# Altium schematic sheet EEM_Connectors.SchDoc: Grabber_DIOT
size 420 x 297 mm; DrawnBy: MMroz; Address1: Warsaw Univeristy of Technology; Address2: Nowowiejska 15/19; SheetNumber: 4; SheetTotal: 5; SPICEModelCacheUDDSOIAX: <root> / <DocumentId>UDDSOIAX</DocumentId> / </root>; Title2: EEM_Connectors
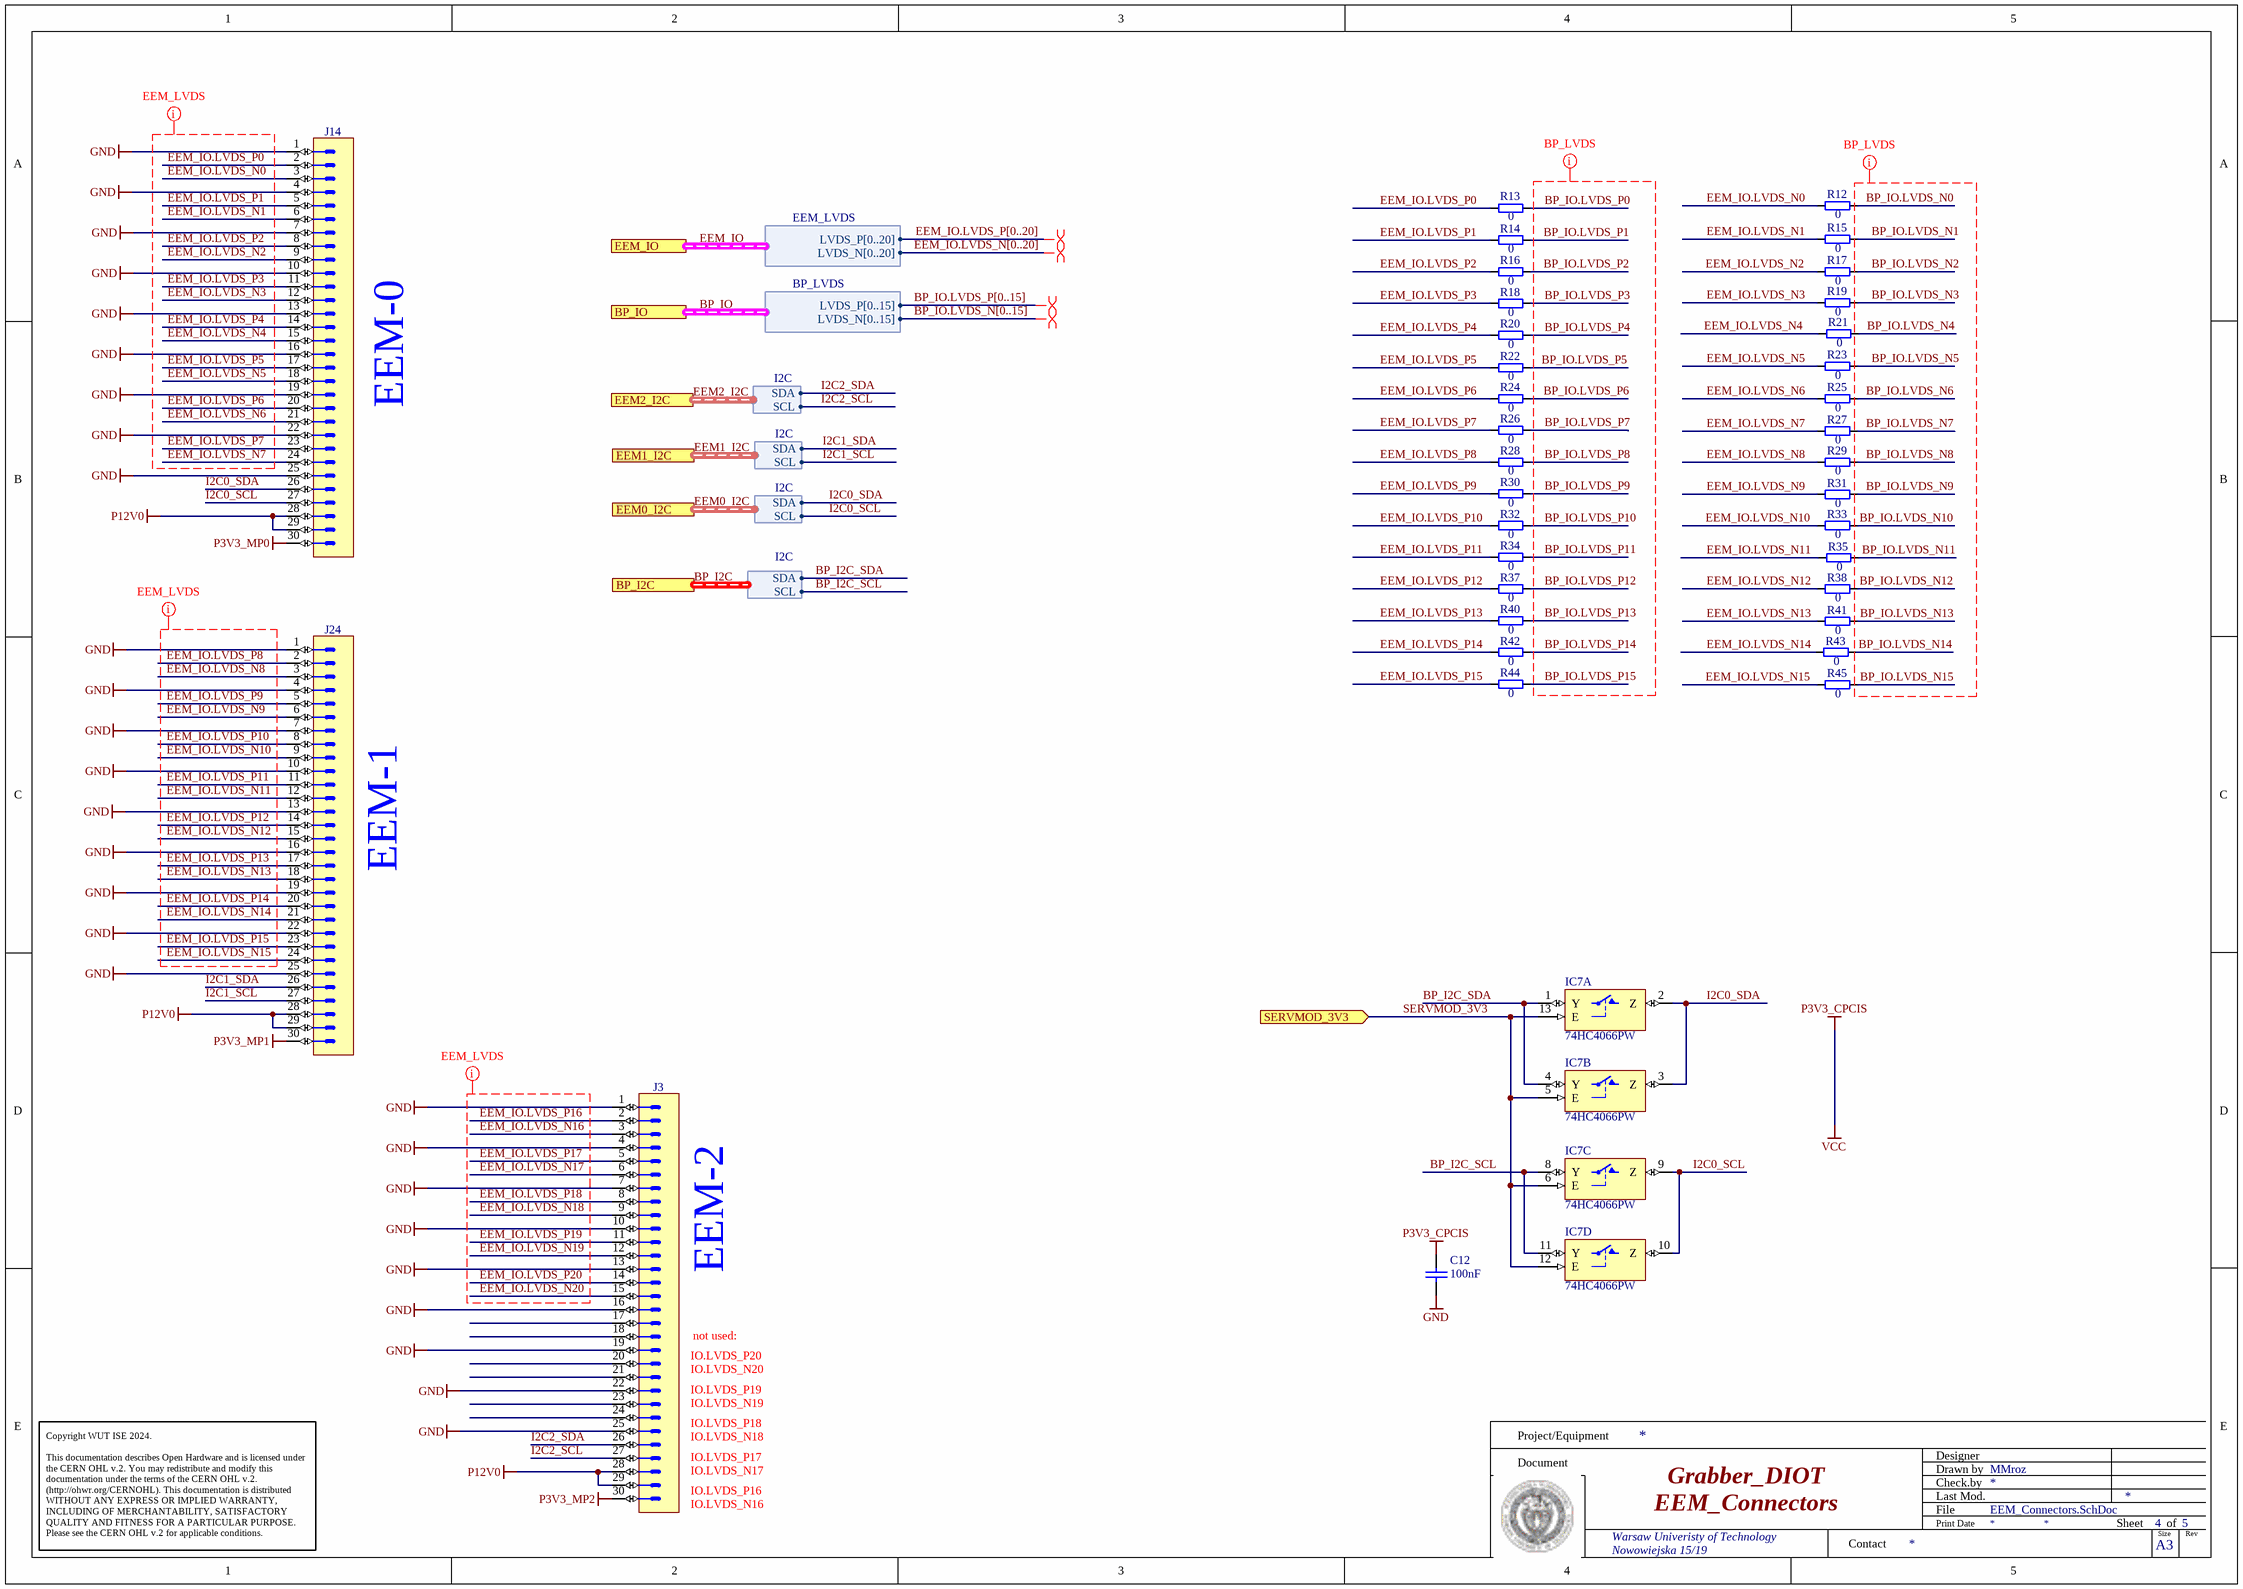
[diagram p0: EEM_Connectors.SchDoc]

## Parts
C12  100nF  [CAPC1608X87N]
IC7  74HC4066PW  [SOP65P640X110-14N]  (parts A,B,C,D of 4)
J3  N2530-6002RB  [3M_N2530-6002RB]  (value not drawn)
J14  N2530-6002RB  [3M_N2530-6002RB]  (value not drawn)
J24  N2530-6002RB  [3M_N2530-6002RB]  (value not drawn)
R12  0  [RESC1005X40N]
R13  0  [RESC1005X40N]
R14  0  [RESC1005X40N]
R15  0  [RESC1005X40N]
R16  0  [RESC1005X40N]
R17  0  [RESC1005X40N]
R18  0  [RESC1005X40N]
R19  0  [RESC1005X40N]
R20  0  [RESC1005X40N]
R21  0  [RESC1005X40N]
R22  0  [RESC1005X40N]
R23  0  [RESC1005X40N]
R24  0  [RESC1005X40N]
R25  0  [RESC1005X40N]
R26  0  [RESC1005X40N]
R27  0  [RESC1005X40N]
R28  0  [RESC1005X40N]
R29  0  [RESC1005X40N]
R30  0  [RESC1005X40N]
R31  0  [RESC1005X40N]
R32  0  [RESC1005X40N]
R33  0  [RESC1005X40N]
R34  0  [RESC1005X40N]
R35  0  [RESC1005X40N]
R37  0  [RESC1005X40N]
R38  0  [RESC1005X40N]
R40  0  [RESC1005X40N]
R41  0  [RESC1005X40N]
R42  0  [RESC1005X40N]
R43  0  [RESC1005X40N]
R44  0  [RESC1005X40N]
R45  0  [RESC1005X40N]

## Ports
BP_I2C (harness I2C), BP_IO (harness BP_LVDS), EEM0_I2C (harness I2C), EEM1_I2C (harness I2C), EEM2_I2C (harness I2C), EEM_IO (harness EEM_LVDS), SERVMOD_3V3 (in)

## Harnesses
EEM_LVDS: LVDS_P[0..20], LVDS_N[0..20]
BP_LVDS: LVDS_P[0..15], LVDS_N[0..15]
I2C: SDA, SCL

## Nets
GND: C12.1 IC7.7(GND) J3.1 J3.4 J3.7 J3.10 J3.13 J3.16 J3.19 J3.22 J3.25 J14.1 J14.4 J14.7 J14.10 J14.13 J14.16 J14.19 J14.22 J14.25 J24.1 J24.4 J24.7 J24.10 J24.13 J24.16 J24.19 J24.22 J24.25
P3V3_CPCIS: C12.2 IC7.14(VCC)  [also labelled VCC]
P3V3_MP0: J14.30
P3V3_MP1: J24.30
P3V3_MP2: J3.30
P12V0: J3.28 J3.29 J14.28 J14.29 J24.28 J24.29
BP_I2C_SCL: IC7.8(Y) IC7.11(Y) ; port BP_I2C.SCL  [project net BP_I2C.SCL]
BP_I2C_SDA: IC7.1(Y) IC7.4(Y) ; port BP_I2C.SDA  [project net BP_I2C.SDA]
BP_IO.LVDS_N0: R12.2
BP_IO.LVDS_N1: R15.2
BP_IO.LVDS_N2: R17.2
BP_IO.LVDS_N3: R19.2
BP_IO.LVDS_N4: R21.2
BP_IO.LVDS_N5: R23.2
BP_IO.LVDS_N6: R25.2
BP_IO.LVDS_N7: R27.2
BP_IO.LVDS_N8: R29.2
BP_IO.LVDS_N9: R31.2
BP_IO.LVDS_N10: R33.2
BP_IO.LVDS_N11: R35.2
BP_IO.LVDS_N12: R38.2
BP_IO.LVDS_N13: R41.2
BP_IO.LVDS_N14: R43.2
BP_IO.LVDS_N15: R45.2
BP_IO.LVDS_P0: R13.2
BP_IO.LVDS_P1: R14.2
BP_IO.LVDS_P2: R16.2
BP_IO.LVDS_P3: R18.2
BP_IO.LVDS_P4: R20.2
BP_IO.LVDS_P5: R22.2
BP_IO.LVDS_P6: R24.2
BP_IO.LVDS_P7: R26.2
BP_IO.LVDS_P8: R28.2
BP_IO.LVDS_P9: R30.2
BP_IO.LVDS_P10: R32.2
BP_IO.LVDS_P11: R34.2
BP_IO.LVDS_P12: R37.2
BP_IO.LVDS_P13: R40.2
BP_IO.LVDS_P14: R42.2
BP_IO.LVDS_P15: R44.2
EEM_IO.LVDS_N0: J14.3 R12.1
EEM_IO.LVDS_N1: J14.6 R15.1
EEM_IO.LVDS_N2: J14.9 R17.1
EEM_IO.LVDS_N3: J14.12 R19.1
EEM_IO.LVDS_N4: J14.15 R21.1
EEM_IO.LVDS_N5: J14.18 R23.1
EEM_IO.LVDS_N6: J14.21 R25.1
EEM_IO.LVDS_N7: J14.24 R27.1
EEM_IO.LVDS_N8: J24.3 R29.1
EEM_IO.LVDS_N9: J24.6 R31.1
EEM_IO.LVDS_N10: J24.9 R33.1
EEM_IO.LVDS_N11: J24.12 R35.1
EEM_IO.LVDS_N12: J24.15 R38.1
EEM_IO.LVDS_N13: J24.18 R41.1
EEM_IO.LVDS_N14: J24.21 R43.1
EEM_IO.LVDS_N15: J24.24 R45.1
EEM_IO.LVDS_N16: J3.3
EEM_IO.LVDS_N17: J3.6
EEM_IO.LVDS_N18: J3.9
EEM_IO.LVDS_N19: J3.12
EEM_IO.LVDS_N20: J3.15
EEM_IO.LVDS_P0: J14.2 R13.1
EEM_IO.LVDS_P1: J14.5 R14.1
EEM_IO.LVDS_P2: J14.8 R16.1
EEM_IO.LVDS_P3: J14.11 R18.1
EEM_IO.LVDS_P4: J14.14 R20.1
EEM_IO.LVDS_P5: J14.17 R22.1
EEM_IO.LVDS_P6: J14.20 R24.1
EEM_IO.LVDS_P7: J14.23 R26.1
EEM_IO.LVDS_P8: J24.2 R28.1
EEM_IO.LVDS_P9: J24.5 R30.1
EEM_IO.LVDS_P10: J24.8 R32.1
EEM_IO.LVDS_P11: J24.11 R34.1
EEM_IO.LVDS_P12: J24.14 R37.1
EEM_IO.LVDS_P13: J24.17 R40.1
EEM_IO.LVDS_P14: J24.20 R42.1
EEM_IO.LVDS_P15: J24.23 R44.1
EEM_IO.LVDS_P16: J3.2
EEM_IO.LVDS_P17: J3.5
EEM_IO.LVDS_P18: J3.8
EEM_IO.LVDS_P19: J3.11
EEM_IO.LVDS_P20: J3.14
I2C0_SCL: IC7.9(Z) IC7.10(Z) J14.27 ; port EEM0_I2C.SCL  [project net EEM0_I2C.SCL]
I2C0_SDA: IC7.2(Z) IC7.3(Z) J14.26 ; port EEM0_I2C.SDA  [project net EEM0_I2C.SDA]
I2C1_SCL: J24.27 ; port EEM1_I2C.SCL  [project net EEM1_I2C.SCL]
I2C1_SDA: J24.26 ; port EEM1_I2C.SDA  [project net EEM1_I2C.SDA]
I2C2_SCL: J3.27 ; port EEM2_I2C.SCL  [project net EEM2_I2C.SCL]
I2C2_SDA: J3.26 ; port EEM2_I2C.SDA  [project net EEM2_I2C.SDA]
SERVMOD_3V3: IC7.5(E) IC7.6(E) IC7.12(E) IC7.13(E) ; port SERVMOD_3V3

Not connected (* = marked no-connect by the designer): J3 17 18 20 21 23 24

## Buses and harness runs
bus BP_IO.LVDS_N[0..15]
bus BP_IO.LVDS_P[0..15]
bus EEM_IO.LVDS_N[0..20]
bus EEM_IO.LVDS_P[0..20]
harness BP_I2C = port BP_I2C
harness BP_IO = port BP_IO
harness EEM0_I2C = port EEM0_I2C
harness EEM1_I2C = port EEM1_I2C
harness EEM2_I2C = port EEM2_I2C
harness EEM_IO = port EEM_IO

## Layout directives
differential pair; differential pair class Diff_100Ohm: (no net found under the mark)
net class EEM_LVDS: EEM_IO.LVDS_N0, EEM_IO.LVDS_N1, EEM_IO.LVDS_N2, EEM_IO.LVDS_N3, EEM_IO.LVDS_N4, EEM_IO.LVDS_N5, EEM_IO.LVDS_N6, EEM_IO.LVDS_N7, EEM_IO.LVDS_N8, EEM_IO.LVDS_N9, EEM_IO.LVDS_N10, EEM_IO.LVDS_N11, EEM_IO.LVDS_N12, EEM_IO.LVDS_N13, EEM_IO.LVDS_N14, EEM_IO.LVDS_N15, EEM_IO.LVDS_N16, EEM_IO.LVDS_N17, EEM_IO.LVDS_N18, EEM_IO.LVDS_N19, EEM_IO.LVDS_N20, EEM_IO.LVDS_P0, EEM_IO.LVDS_P1, EEM_IO.LVDS_P2, EEM_IO.LVDS_P3, EEM_IO.LVDS_P4, EEM_IO.LVDS_P5, EEM_IO.LVDS_P6, EEM_IO.LVDS_P7, EEM_IO.LVDS_P8, EEM_IO.LVDS_P9, EEM_IO.LVDS_P10, EEM_IO.LVDS_P11, EEM_IO.LVDS_P12, EEM_IO.LVDS_P13, EEM_IO.LVDS_P14, EEM_IO.LVDS_P15, EEM_IO.LVDS_P16, EEM_IO.LVDS_P17, EEM_IO.LVDS_P18, EEM_IO.LVDS_P19, EEM_IO.LVDS_P20
net class BP_LVDS: BP_IO.LVDS_N0, BP_IO.LVDS_N1, BP_IO.LVDS_N2, BP_IO.LVDS_N3, BP_IO.LVDS_N4, BP_IO.LVDS_N5, BP_IO.LVDS_N6, BP_IO.LVDS_N7, BP_IO.LVDS_N8, BP_IO.LVDS_N9, BP_IO.LVDS_N10, BP_IO.LVDS_N11, BP_IO.LVDS_N12, BP_IO.LVDS_N13, BP_IO.LVDS_N14, BP_IO.LVDS_N15, BP_IO.LVDS_P0, BP_IO.LVDS_P1, BP_IO.LVDS_P2, BP_IO.LVDS_P3, BP_IO.LVDS_P4, BP_IO.LVDS_P5, BP_IO.LVDS_P6, BP_IO.LVDS_P7, BP_IO.LVDS_P8, BP_IO.LVDS_P9, BP_IO.LVDS_P10, BP_IO.LVDS_P11, BP_IO.LVDS_P12, BP_IO.LVDS_P13, BP_IO.LVDS_P14, BP_IO.LVDS_P15

## Notes on the sheet
- (near J14) EEM-0
- (near J24) EEM-1
- (near J3) EEM-2
- not used:
- (near J3) IO.LVDS_P20
- (near J3) IO.LVDS_N20
- (near J3) IO.LVDS_P19
- (near J3) IO.LVDS_N19
- (near J3) IO.LVDS_P18
- (near J3) IO.LVDS_N18
- (near J3) IO.LVDS_P17
- (near J3) IO.LVDS_N17
- (near J3) IO.LVDS_P16
- (near J3) IO.LVDS_N16
- Project/Equipment
- Document
- Designer
- Drawn by
- Check.by
- Copyright WUT ISE 2024.
  This documentation describes Open Hardware and is licensed under the CERN OHL v.2. You may redistribute and modify this documentation under the terms of the CERN OHL v.2. (http://ohwr.org/CERNOHL). This documentation is distributed WITHOUT ANY EXPRESS OR IMPLIED WARRANTY, INCLUDING OF MERCHANTABILITY, SATISFACTORY QUALITY AND FITNESS FOR A PARTICULAR PURPOSE. Please see the CERN OHL v.2 for applicable conditions.
- Contact
- File
- Last Mod.
- Print Date
- Sheet
- Size
- A3
- of
- Rev

## Library data of the parts
C12 = CC0603_100NF_50V_10%_X7R: Non-polarised capacitor; Part Description: SMD Multilayer Chip Ceramic Capacitor; Manufacturer: GENERIC; Manufacturer1 Part Number: 223858615649; Voltage: 50V; TC: X7R; Tolerance: ±10%; Part Number: CC0603_100NF_50V_10%_X7R; Component Kind: Standard; Component Type: Standard; Pin Count: 2; Value: 100nF; Status: Preferred; Manufacturer Part Number: CC0603_100NF_50V_10%_X7R; Case: 0603; Mounted: Yes; Socket: No; SMD: Yes; Sense: No; Manufacturer1 Example: PHYCOMP; Manufacturer1 ComponentHeight: 0.87mm; HelpURL: \\cern.ch\dfs\Applications\Altium\Datasheets\CC0603_X7R_PHYCOMP.pdf; Author: CERN DEM JLC; CreateDate: 03.12.2007; LatestRevisionDate: 03.12.2007
IC7 = 74HC4066PW: Part Description: Quad Single-Pole Single-Throw Analog Switch; Manufacturer: NXP SEMICONDUCTORS; PressFit: No; Bonding: No; Part Number: 74HC4066PW; Component Kind: Standard; Component Type: Standard; Device: 74HC4066PW; PackageDescription: SOP, 0.65mm Pitch; 14 Pin, 4.40mm W X 5.00mm L X 1.20mm H body, IPC Medium Density; Manufacturer Part Number: 74HC4066PW; Pin Count: 14; Case: TSSOP14; Mounted: Yes; Socket: No; SMD: Yes; Sense: No; ComponentHeight: 1.1mm; Author: CERN DEM JLC; HelpURL: \\cern.ch\dfs\Applications\Altium\Datasheets\74HC4066PW.pdf; CreateDate: 19.11.2014; LatestRevisionDate: 19.11.2014
J3 J14 J24 = 3M_N2530-6002RB: 30 Contacts - Straight .100'' x .100'' Low Profile Four-Wall Header, 2500 Series; Manufacturer: 3M; PressFit: No; Part Number: 3M_N2530-6002RB; Component Kind: Standard; Component Type: Standard; Pin Count: 30; Family: Header 30; Mounted: Yes; Socket: No; SMD: No; Sense: No; Status: None; Part Description: 30 Contacts - Straight .100'' x .100'' Low Profile Four-Wall Header, 2500 Series; Manufacturer Part Number: N2530-6002RB; ComponentHeight: 10.03mm; HelpURL: \\cern.ch\dfs\Applications\Altium\Datasheets\3M_N2530-6002RB.pdf; Author: CERN DEM JLC; CreateDate: 11.02.2009; LatestRevisionDate: 11.08.2009
R12-R35 R37 R38 R40-R45 = R0402_0R_JUMPER: Resistor; Part Description: 1A (0.05R Max DC Resistance) Zero Ohm Jumper; Manufacturer: GENERIC; Manufacturer1 Part Number: 232270591001L; Part Number: R0402_0R_JUMPER; Component Kind: Standard; Component Type: Standard; Pin Count: 2; Value: 0; Status: Not recommended; Manufacturer Part Number: R0402_0R_JUMPER; Case: 0402; Mounted: Yes; Sense: No; Socket: No; SMD: Yes; Manufacturer1 Example: YAGEO PHYCOMP; Manufacturer1 ComponentHeight: 0.4mm; HelpURL: \\cern.ch\dfs\Applications\Altium\Datasheets\R0402_Phycomp_RC0402.pdf; Author: CERN DEM JLC; CreateDate: 03.12.2007; LatestRevisionDate: 17.10.2012